# Altium schematic sheet 电池模块.SchDoc
size A4
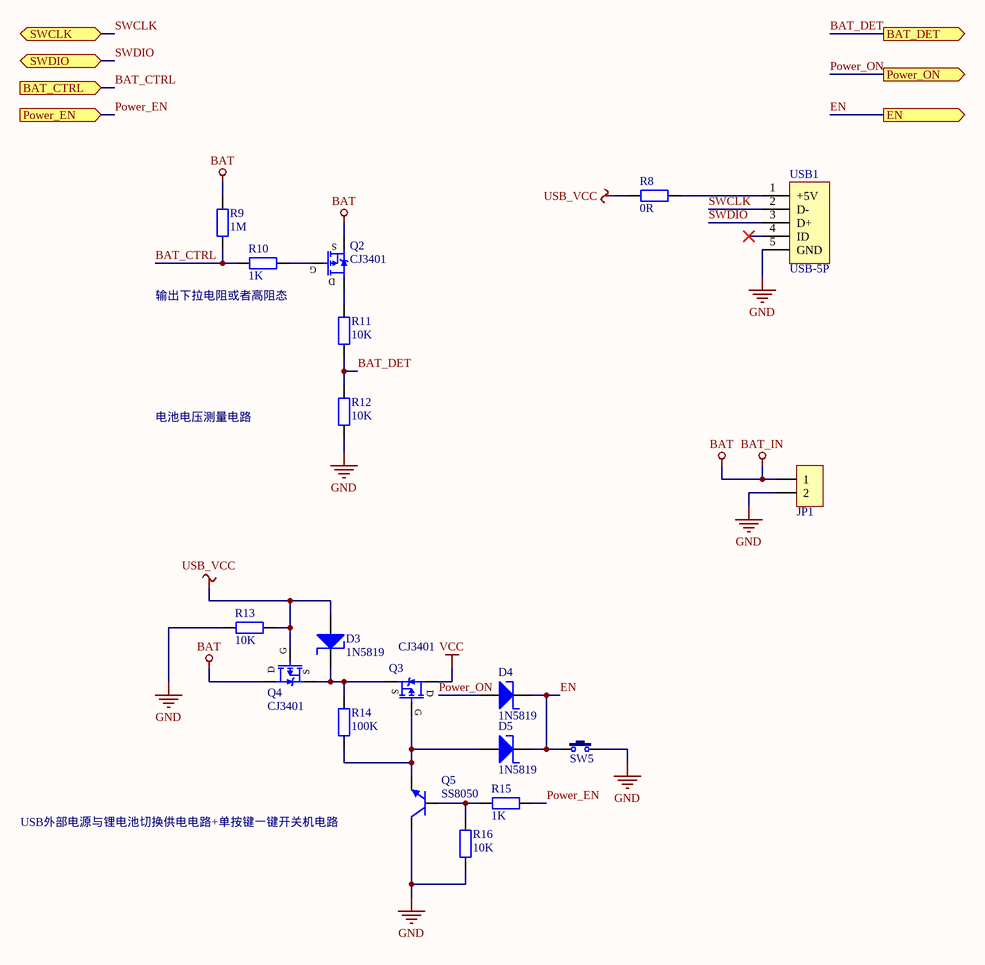
[diagram p0: 电池模块.SchDoc]

## Parts
D3  1N5819  [SOD-323]
D4  1N5819  [SOD-323]
D5  1N5819  [SOD-323]
JP1  HDR-1X2  [HDR2.54-LI-2P]  (value not drawn)
Q2  CJ3401  [SOT23-3L]
Q3  CJ3401  [SOT23-3L]
Q4  CJ3401  [SOT23-3L]
Q5  SS8050  [SOT23-3N]
R8  0R  [R 0603_L]
R9  1M  [R 0603_L]
R10  1K  [R 0603_L]
R11  10K  [R 0603_L]
R12  10K  [R 0603_L]
R13  10K  [R 0603_L]
R14  100K  [R 0603_L]
R15  1K  [R 0603_L]
R16  10K  [R 0603_L]
SW5  3x6x5  [TSW 4.6*1.82*3.5-S-W]  (value not drawn)
USB1  USB-5P  [USB-MICRO_A]

## Ports
BAT_CTRL (in), BAT_DET (out), EN (out), Power_EN (in), Power_ON (out), SWCLK (bidir), SWDIO (bidir)

## Nets
BAT: JP1.1 Q2.3(D) Q4.2(S) R9.1  [also labelled BAT_IN]
GND: JP1.2 Q5.3(C) R12.2 R13.2 R16.2 SW5.2 USB1.5(GND)
USB_VCC: D3.1(A) Q4.1(G) R8.2 R13.1
VCC: Q3.2(S)
BAT_CTRL: R9.2 R10.1 ; port BAT_CTRL
BAT_DET: R11.2 R12.1 ; port BAT_DET
EN: D4.2(K) D5.2(K) SW5.1 ; port EN
Power_EN: R15.2 ; port Power_EN
Power_ON: D4.1(A) ; port Power_ON
SWCLK: USB1.2(D-) ; port SWCLK
SWDIO: USB1.3(D+) ; port SWDIO
NetD3_2: D3.2(K) Q3.3(D) Q4.3(D) R14.1
NetD5_1: D5.1(A) Q3.1(G) Q5.2(E) R14.2
NetQ2_1: Q2.1(G) R10.2
NetQ2_2: Q2.2(S) R11.1
NetQ5_1: Q5.1(B) R15.1 R16.1
NetR8_1: R8.1 USB1.1(+5V)

Not connected (* = marked no-connect by the designer): USB1 4(ID)*

## Notes on the sheet
- 输出下拉电阻或者高阻态
- 电池电压测量电路
- USB外部电源与锂电池切换供电电路+单按键一键开关机电路

## Library data of the parts
D3-D5 = 1N5819: 肖特基二极管; 版权归属: 源创客; 属性: 40V/2A; BOM名称: 肖特基二极管; 学习资源: www.ooocke.com
JP1 = Header 2: 2P接插件; 版权归属: 源创客; BOM名称: 2P接插件; 学习资源: www.ooocke.com
Q2-Q4 = CJ3401: P沟道 30V/4.2A
Q5 = 8050-SMD: 高频放大-NPN型 丝印J3Y; 版权归属: 源创客; 属性: 40V 1.5A 1W 100MHZ; BOM名称: 高频放大-NPN型; 学习资源: www.ooocke.com
R8-R16 = R: 贴片电阻; 版权归属: 黎明电子style; BOM名称: 贴片电阻; 学习资源: https://lmdzstyle.taobao.com/
SW5 = TSW 3x6: 3x6轻触开关; 版权归属: 源创客; BOM名称: 3x6轻触开关; 学习资源: www.ooocke.com
USB1 = USB-5P: 微型USB母座; 版权归属: 源创客; BOM名称: 微型USB母座; 学习资源: www.ooocke.com